# EasyEDA schematic 1-Schematic_GEEKIMUv3.3.json
TITLE: Sheet_1; REV: 1.0; Date: 2021-06-28; Sheet: 1/1; Drawn By: logzhan; Company: Your Company
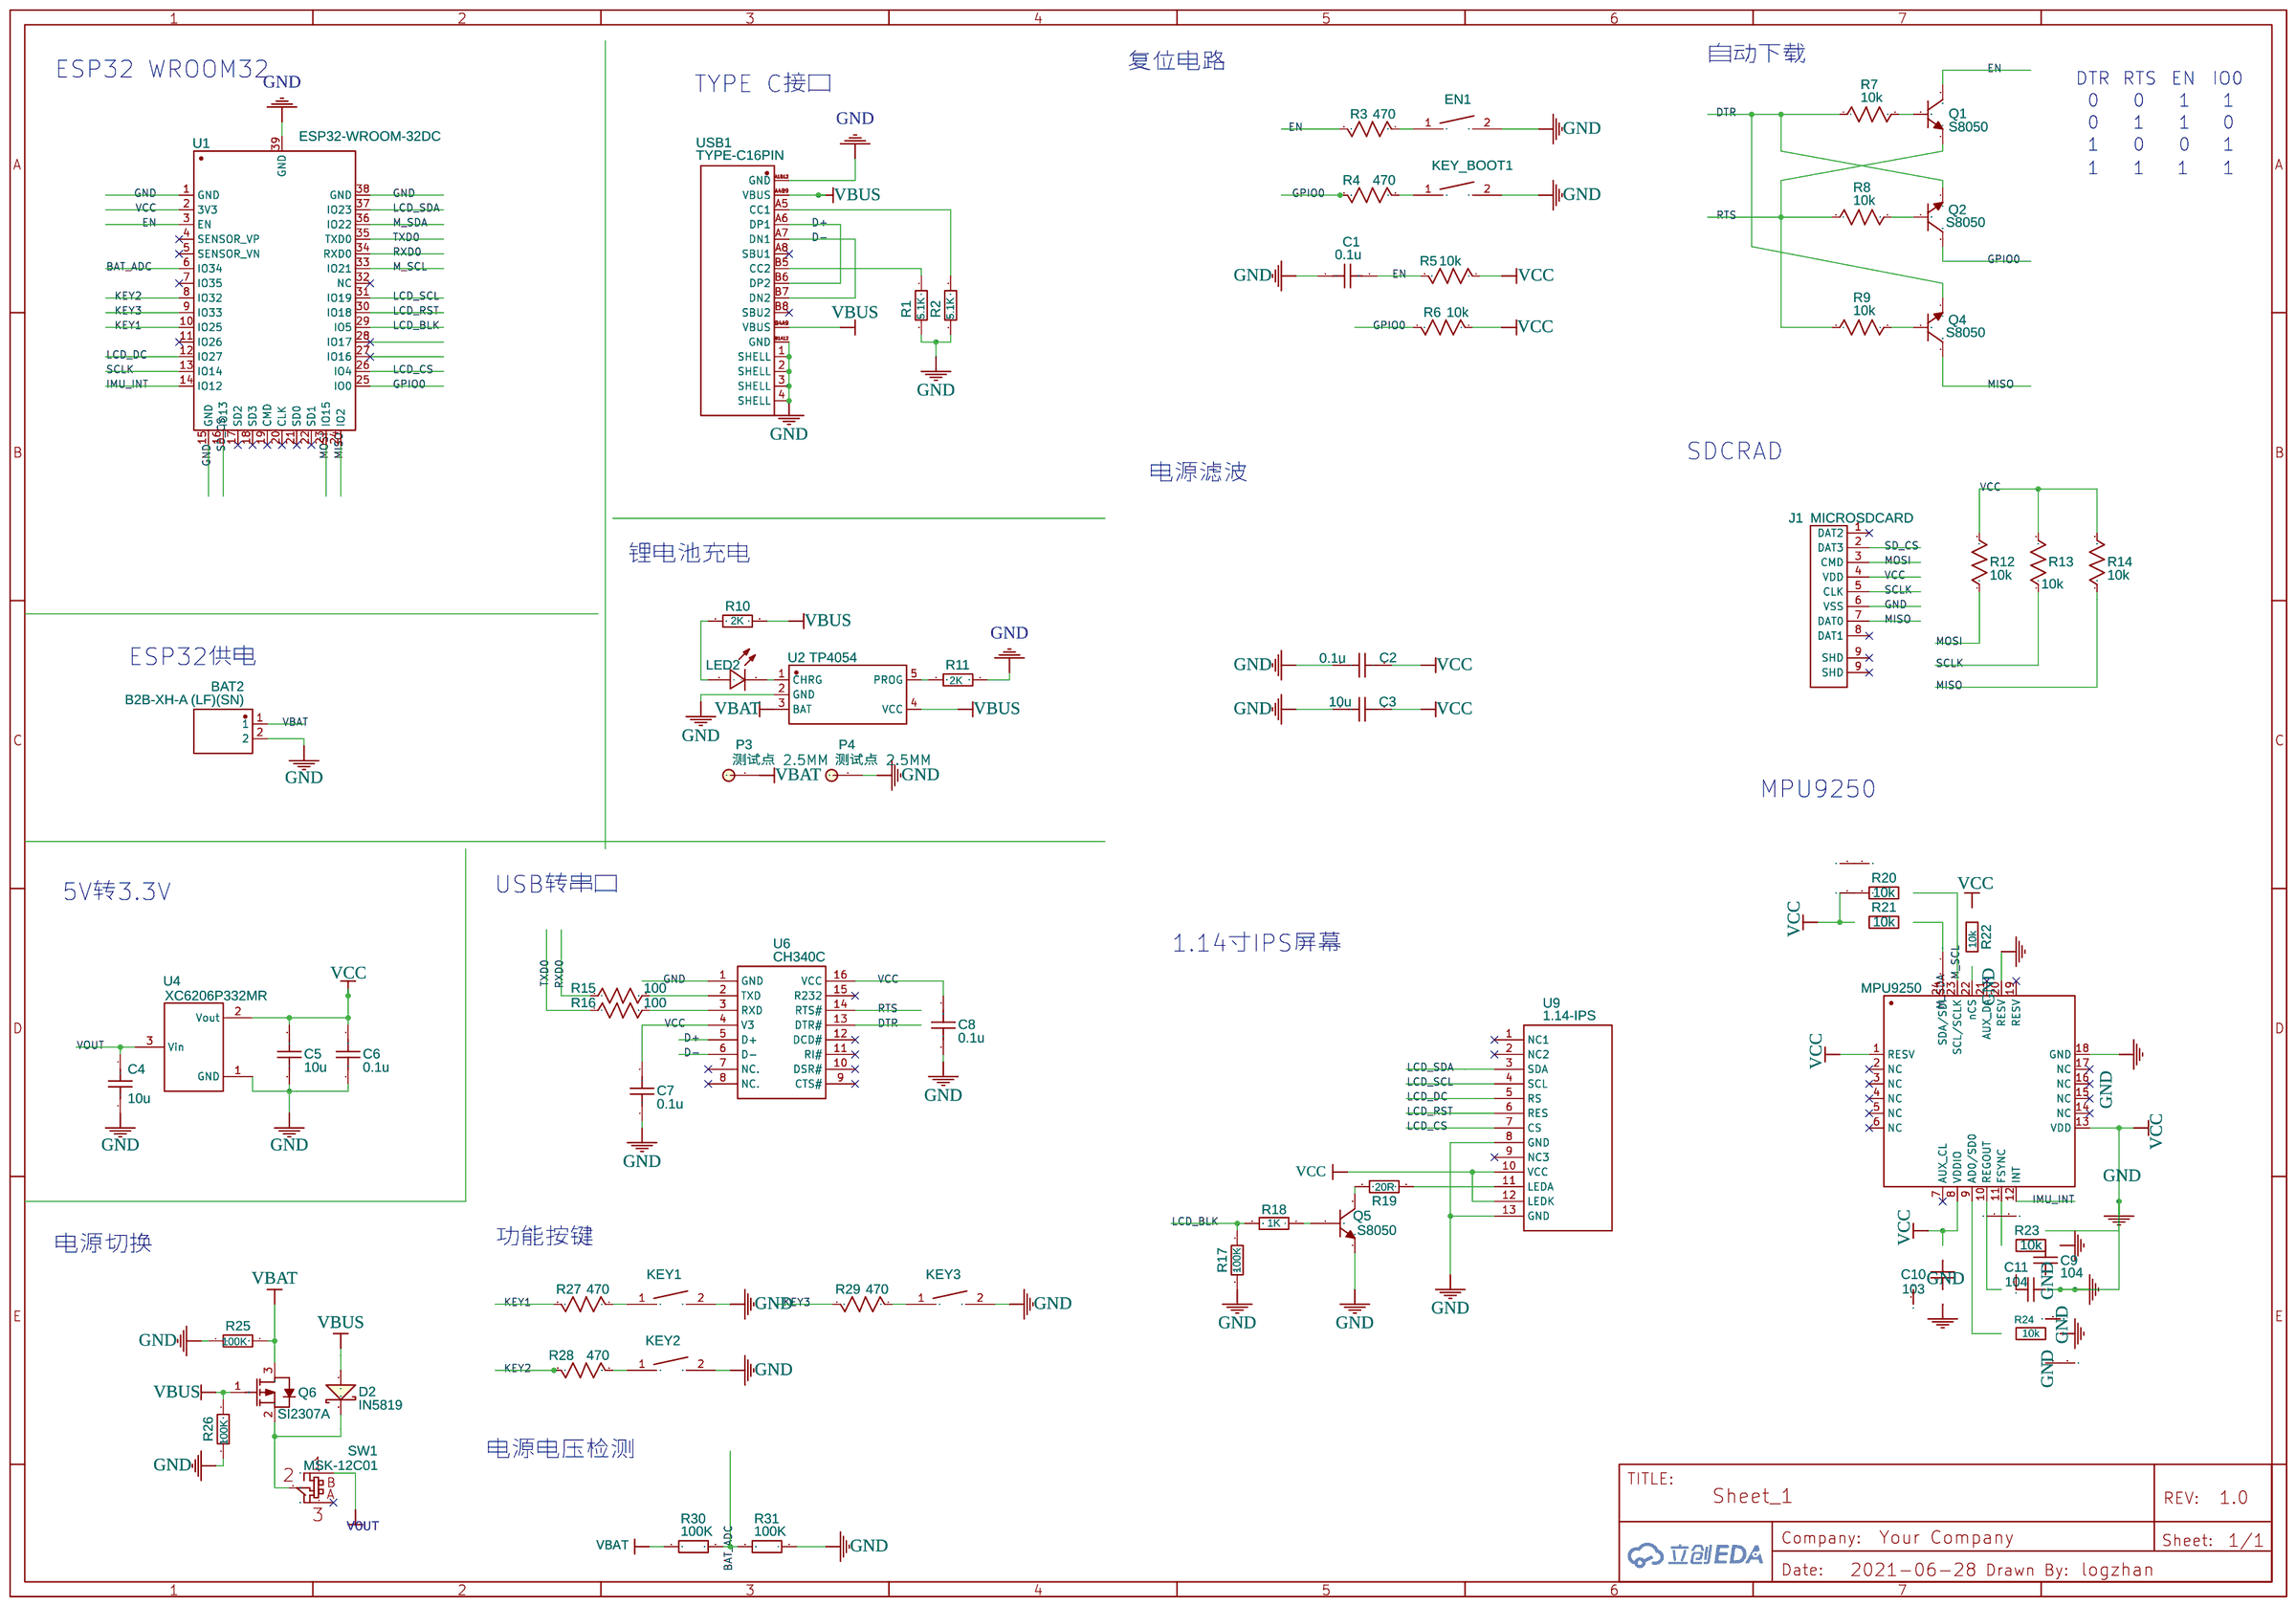
[diagram p0: schematic sheet]

## Parts
BAT2  B2B-XH-A (LF)(SN)  [CONN-SMD_2P-P1.25_DF13C-2P-1.25V]
C1  0.1u  [C0402]
C2  0.1u  [C0402]
C3  10u  [C0603]
C4  10u  [C0603]
C5  10u  [C0603]
C6  0.1u  [C0402]
C7  0.1u  [C0402]
C8  0.1u  [C0402]
C9  104  [C0402]
C10  103  [C0402]
C11  104  [C0402]
D2  IN5819  [SMA/DO-214AC]
EN1  TSA343G00D-250J2  [SW-SMD_L4.0-W2.9-LS5.0]
J1  MICROSDCARD  [MICROSDCARD]
KEY1  TSA343G00D-250J2  [SW-SMD_L4.0-W2.9-LS5.0]
KEY2  TSA343G00D-250J2  [SW-SMD_L4.0-W2.9-LS5.0]
KEY3  TSA343G00D-250J2  [SW-SMD_L4.0-W2.9-LS5.0]
KEY_BOOT1  TSA343G00D-250J2  [SW-SMD_L4.0-W2.9-LS5.0]
LED2  0603 led  [LED-SMD_0603-T]
MPU9250  MPU9250  [MPU9250]
P3  测试点 2.5MM  [测试点 2.5MM]
P4  测试点 2.5MM  [测试点 2.5MM]
Q1  S8050  [SOT-23-3_L2.9-W1.3-P1.90-LS2.4-TR]
Q2  S8050  [SOT-23-3_L2.9-W1.3-P1.90-LS2.4-TR]
Q4  S8050  [SOT-23-3_L2.9-W1.3-P1.90-LS2.4-TR]
Q5  S8050  [SOT-23-3_L2.9-W1.3-P1.90-LS2.4-BR]
Q6  SI2307A  [SOT-23-3_L3.0-W1.7-P0.95-LS2.9-BR]
R1  5.1K  [R0402]
R2  5.1K  [R0402]
R3  470  [R0402]
R4  470  [R0402]
R5  10k  [R0402]
R6  10k  [R0402]
R7  10k  [R0402]
R8  10k  [R0402]
R9  10k  [R0402]
R10  2K  [0603]
R11  2K  [R0402]
R12  10k  [R0402]
R13  10k  [R0402]
R14  10k  [R0402]
R15  100  [R0402]
R16  100  [R0402]
R17  100K  [R0402]
R18  1K  [R0402]
R19  20R  [R0402]
R20  10k  [R0402]
R21  10k  [R0402]
R22  10k  [R0402]
R23  10k  [R0402]
R24  10k  [R0402]
R25  100K  [0603]
R26  100K  [0603]
R27  470  [R0402]
R28  470  [R0402]
R29  470  [R0402]
R30  100K  [0603]
R31  100K  [0603]
SW1  MSK-12C01  [MSK-12C01]
U1  ESP32-WROOM-32DC  [WIFIM-SMD_38P-L25.5-W18.0-P1.27]
U2  TP4054  [SOT-23-5_L3.0-W1.7-P0.95-LS2.8-BL]
U4  XC6206P332MR  [SOT-23(SOT-23-3)]
U6  CH340C  [SOP-16_L10.0-W3.9-P1.27-LS6.0-BL]
U9  1.14-IPS  [1.14-IPS]
USB1  TYPE-C16PIN  [USB-C-SMD_TYPE-C16PIN]

## Library data of the parts
BAT2 = B2B-XH-A (LF)(SN): Supplier: LCSC; Supplier Part: C158012; Manufacturer: JST Sales America; Contributor: LCSC
C1 C2 C7 C8 = C_0805_US: Supplier Part: C282732; Supplier: LCSC; Contributor: LCEDA_Lib; Manufacturer Part: TCC0805X7R104K500DT; Manufacturer: CCTC
C3 = C_0805_US: Supplier Part: C9807; Supplier: LCSC; Contributor: LCEDA_Lib; Manufacturer Part: CL31A106KAHNNNE; Manufacturer: SAMSUNG
C4 C5 = Cap_0805_US: Manufacturer Part: CC0805KRX5R6BB106; Supplier: LCSC; Manufacturer: YAGEO; Supplier Part: C272880
C6 = Cap_0805_US: Manufacturer Part: TCC0805X7R104K500DT; Supplier: LCSC; Manufacturer: CCTC; Supplier Part: C282732
C9-C11 = Capacitor: Manufacturer Part: ?
D2 = IN5819
EN1 KEY2 KEY3 KEY_BOOT1 = TSA343G00D-250J2: Supplier: LCSC; Supplier Part: C354947; Manufacturer: BRIGHT; Contributor: LCSC; Paste Type: expand; Assembly Type: smtWeld
J1 = MICROSDCARD: Contributor: Tinkerforge; Package Display: No
KEY1 = TSA343G00D-250J2: Supplier: LCSC; Supplier Part: C354947; Manufacturer: BRIGHT; Contributor: LCSC; Paste Type: expand; Assembly Type: smtWeld; Package Display: No
LED2 = 0603 led: Supplier: LCSC; Supplier Part: C375573; Manufacturer: EKINGLUX; Manufacturer Part: E6Q0603URAC1UDA; Contributor: LCSC
MPU9250 = -: Manufacturer Part: ?
P3 P4 = 测试点 2.5MM: Contributor: liuzewen
Q1 Q2 Q4 = 2N3904(SOT-23): Supplier: LCSC; Manufacturer: KEC; Manufacturer Part: 2n3904S-RTK/PS; Supplier Part: C18536; SMT Type: SOT-23; Contributor: LCEDA_Lib
Q5 = S8050-C139514: Supplier: LCSC; Manufacturer: Yenji; Contributor: 立创EDA官方封装库; Supplier Part: C139514; LCSC Assembly: Yes; SMT Type: Extend
Q6 = SI2307A: Supplier: LCSC; Supplier Part: C347490; Manufacturer: Youtai Semiconductor Co., Ltd.; Contributor: LCSC; LCSC Assembly: Yes; SMT Type: Extend
R1 R2 R10 R11 R17-R19 R25 R26 = AF0603FR-0710KL: Supplier: LCSC; Manufacturer: YAGEO; Contributor: LCSC; Supplier Part: C144081
R3 R4 R27-R29 = R_0805_US: Supplier Part: C114564; Supplier: LCSC; Contributor: LCEDA_Lib; Manufacturer Part: RC0805FR-07470RL; Manufacturer: YAGEO
R5-R9 = R_0805_US: Supplier Part: C103904; Supplier: LCSC; Contributor: LCEDA_Lib; Manufacturer Part: RTT051002FTP; Manufacturer: RALEC
R12-R14 = R_0603_US: Contributor: LCEDA_Lib
R15 R16 = R_0805_US: Supplier Part: C101403; Supplier: LCSC; Contributor: LCEDA_Lib; Manufacturer Part: CR0805F81000G; Manufacturer: LIZ
R20-R24 = Resistor: Manufacturer Part: ?
R30 R31 = 0603WAF3243T5E: Supplier: LCSC; Supplier Part: C246851; Manufacturer: Uniroyal Elec; Contributor: LCSC; LCSC Assembly: Yes; SMT Type: Extend
SW1 = MSK-12C01: Manufacturer: HRO; Contributor: zhkrid; Supplier Part: C128955
U1 = ESP32-WROOM-32DC: Supplier: LCSC; Supplier Part: C473013; Manufacturer: Espressif Systems; Contributor: LCSC
U2 = TP4054: sourceId: dx642CAWU; Contributor: kyle.hu.gz; Supplier: LCSC; Manufacturer: TOPPOWER; LCSC Assembly: Yes; image: //image.lceda.cn/szlcsc/C32574.jpg; Supplier Part: C32574; SMT Type: Basic
U4 = -: Supplier: LCSC; Manufacturer: TOREX; LCSC Assembly: Yes; image: //image.lceda.cn/szlcsc/C5446.jpg; Supplier Part: C5446; SMT Type: Basic
U6 = CH340C: Supplier: LCSC; Manufacturer: WCH; Supplier Part: C84681; LCSC Assembly: Yes; SMT Type: Extend
U9 = 1.14-IPS: Contributor: gbsf
USB1 = TYPE-C16PIN: Supplier: LCSC; Supplier Part: C393939; Manufacturer: SHOU HAN; Contributor: LCSC

## Nets
GND: BAT2.2 C1.1 C2.1 C2.2 C3.1 C3.2 C4.2 C5.1 C5.2 C6.1 C6.2 C7.1 C7.2 C8.1 C8.2 C9.1 C9.2 C10.1 C10.2 C11.1 EN1.2 J1.4(VDD) J1.6(VSS) KEY1.2 KEY2.2 KEY3.2 KEY_BOOT1.2 MPU9250.1(RESV) MPU9250.8(VDDIO) MPU9250.13(VDD) MPU9250.18(GND) MPU9250.20(RESV) P4.1 Q5.2(E) R1.2 R2.2 R5.1 R6.1 R11.1 R12.2 R13.2 R14.2 R17.2 R20.1 R21.1 R22.2 R23.2 R24.1 R25.1 R26.2 R31.1 U1.1(GND) U1.2(3V3) U1.15(GND) U1.38(GND) U1.39(GND) U2.2(GND) U4.1(GND) U4.2(Vout) U6.1(GND) U6.4(V3) U6.16(VCC) U9.8(GND) U9.10(VCC) U9.12(LEDK) U9.13(GND) USB1.1(SHELL) USB1.2(SHELL) USB1.3(SHELL) USB1.4(SHELL) USB1.A1B12(GND) USB1.B1A12(GND)
VBAT: BAT2.1 P3.1 Q6.3(D) R25.2 R30.2 U2.3(BAT)
VBUS: D2.1 Q6.1(G) R10.1 R26.1 U2.4(VCC) USB1.A4B9(VBUS) USB1.B4A9(VBUS)
BAT_ADC: R30.1 R31.2 U1.6(IO34)
D+: U6.5(D+) USB1.A6(DP1) USB1.B6(DP2)
D-: U6.6(D-) USB1.A7(DN1) USB1.B7(DN2)
DTR: Q2.1(E) Q4.1(E) R7.1 U6.13(DTR#)
EN: C1.2 Q1.3(C) R3.2 R5.2 U1.3(EN)
GPIO0: Q2.3(C) R4.2 R6.2 U1.25(IO0)
IMU_INT: MPU9250.12(INT) U1.14(IO12)
KEY1: R27.2 U1.10(IO25)
KEY2: R28.2 U1.8(IO32)
KEY3: R29.2 U1.9(IO33)
LCD_BLK: R17.1 R18.2 U1.29(IO5)
LCD_CS: U1.26(IO4) U9.7(CS)
LCD_DC: U1.12(IO27) U9.5(RS)
LCD_RST: U1.30(IO18) U9.6(RES)
LCD_SCL: U1.31(IO19) U9.4(SCL)
LCD_SDA: U1.37(IO23) U9.3(SDA)
M_SCL: MPU9250.23(SCL/SCLK) R20.2 U1.33(IO21)
M_SDA: MPU9250.24(SDA/SDI) R21.2 U1.36(IO22)
MISO: J1.7(DAT0) Q4.3(C) R14.1 U1.24(IO2)
MOSI: J1.3(CMD) R12.1 U1.23(IO15)
RTS: Q1.1(E) R8.1 R9.1 U6.14(RTS#)
RXD0: R15.1 U1.34(RXD0)
SCLK: J1.5(CLK) R13.1 U1.13(IO14)
SD_CS: J1.2(DAT3) U1.16(IO13)
TXD0: R16.1 U1.35(TXD0)
VOUT: C4.1 SW1.1 U4.3(Vin)
Net-(C11-2): C11.2 MPU9250.10(REGOUT)
Net-(D2-2): D2.2 Q6.2(S) SW1.2
Net-(EN1-1): EN1.1 R3.1
Net-(KEY1-1): KEY1.1 R27.1
Net-(KEY2-1): KEY2.1 R28.1
Net-(KEY3-1): KEY3.1 R29.1
Net-(KEY_BOOT1-1): KEY_BOOT1.1 R4.1
Net-(LED2-1): LED2.1(-) U2.1(CHRG)
Net-(LED2-2): LED2.2(+) R10.2
Net-(MPU9250-9): MPU9250.9(AD0/SD0) R24.2
Net-(MPU9250-11): MPU9250.11(FSYNC) R23.1
Net-(MPU9250-22): MPU9250.22(nCS) R22.1
Net-(Q1-2): Q1.2(B) R7.2
Net-(Q2-2): Q2.2(B) R8.2
Net-(Q4-2): Q4.2(B) R9.2
Net-(Q5-1): Q5.1(B) R18.1
Net-(Q5-3): Q5.3(C) R19.2
Net-(R1-1): R1.1 USB1.B5(CC2)
Net-(R2-1): R2.1 USB1.A5(CC1)
Net-(R11-2): R11.2 U2.5(PROG)
Net-(R15-2): R15.2 U6.2(TXD)
Net-(R16-2): R16.2 U6.3(RXD)
Net-(R19-1): R19.1 U9.11(LEDA)

Not connected (* = marked no-connect by the designer): J1 1(DAT2)* 8(DAT1)* 9(SHD)*; MPU9250 2(NC)* 3(NC)* 4(NC)* 5(NC)* 6(NC)* 7(AUX_CL)* 14(NC)* 15(NC)* 16(NC)* 17(NC)* 19(RESV)* 21(AUX_DA)*; SW1 3*; U1 4(SENSOR_VP)* 5(SENSOR_VN)* 7(IO35)* 11(IO26)* 17(SD2)* 18(SD3)* 19(CMD)* 20(CLK)* 21(SD0)* 22(SD1)* 27(IO16)* 28(IO17)* 32(NC)*; U6 7(NC.)* 8(NC.)* 9(CTS#)* 10(DSR#)* 11(RI#)* 12(DCD#)* 15(R232)*; U9 1(NC1)* 2(NC2)* 9(NC3)*; USB1 A8(SBU1)* B8(SBU2)*

## Notes on the sheet
- 复位电路
- 自动下载
- ESP32 WROOM32
- TYPE C接口
- DTR
- RTS
- EN
- IO0
- 0
- 0
- 1
- 1
- 0
- 1
- 1
- 0
- 1
- 0
- 0
- 1
- 1
- 1
- 1
- 1
- SDCRAD
- 电源滤波
- 锂电池充电
- ESP32供电
- MPU9250
- 5V转3.3V
- USB转串口
- 1.14寸IPS屏幕
- 功能按键
- 电源切换
- 电源电压检测
